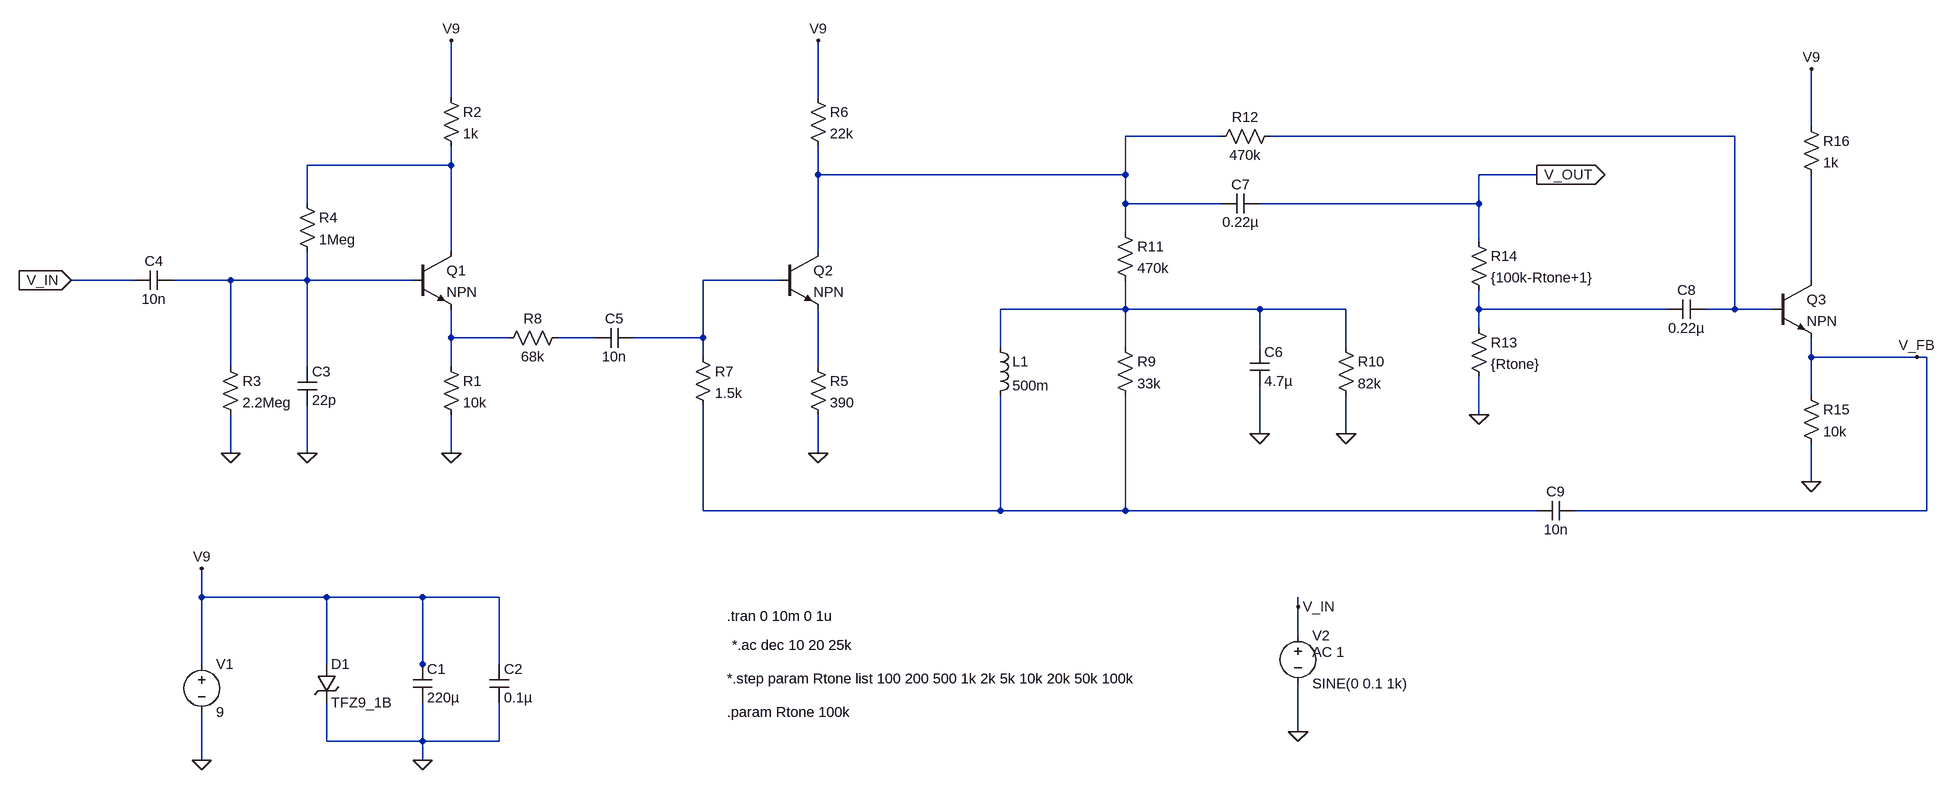
[diagram p0: schematic dunlop_crybaby.asc]
dunlop_crybaby.asc, the LTspice schematic file:
Version 4
SHEET 1 3760 680
WIRE 1072 -1056 1072 -1152
WIRE 1712 -1056 1712 -1152
WIRE 3536 -1008 3536 -1104
WIRE 2384 -992 2224 -992
WIRE 3408 -992 2464 -992
WIRE 1072 -944 1072 -976
WIRE 1072 -944 832 -944
WIRE 1712 -928 1712 -976
WIRE 2224 -928 2224 -992
WIRE 2224 -928 1712 -928
WIRE 2928 -928 2832 -928
WIRE 832 -880 832 -944
WIRE 2224 -880 2224 -928
WIRE 2384 -880 2224 -880
WIRE 2832 -880 2832 -928
WIRE 2832 -880 2448 -880
WIRE 2224 -832 2224 -880
WIRE 2832 -816 2832 -880
WIRE 1072 -800 1072 -944
WIRE 1712 -800 1712 -928
WIRE 544 -752 432 -752
WIRE 704 -752 608 -752
WIRE 832 -752 832 -800
WIRE 832 -752 704 -752
WIRE 1008 -752 832 -752
WIRE 1648 -752 1520 -752
WIRE 3536 -752 3536 -928
WIRE 2224 -704 2224 -752
WIRE 2224 -704 2016 -704
WIRE 2448 -704 2224 -704
WIRE 2592 -704 2448 -704
WIRE 2832 -704 2832 -736
WIRE 3296 -704 2832 -704
WIRE 3408 -704 3408 -992
WIRE 3408 -704 3360 -704
WIRE 3472 -704 3408 -704
WIRE 2832 -672 2832 -704
WIRE 1072 -656 1072 -704
WIRE 1168 -656 1072 -656
WIRE 1312 -656 1248 -656
WIRE 1520 -656 1520 -752
WIRE 1520 -656 1376 -656
WIRE 2016 -640 2016 -704
WIRE 2224 -640 2224 -704
WIRE 2448 -640 2448 -704
WIRE 2592 -640 2592 -704
WIRE 1520 -624 1520 -656
WIRE 3536 -624 3536 -656
WIRE 3712 -624 3536 -624
WIRE 3728 -624 3712 -624
WIRE 704 -608 704 -752
WIRE 832 -608 832 -752
WIRE 1072 -608 1072 -656
WIRE 1712 -608 1712 -704
WIRE 3536 -560 3536 -624
WIRE 2832 -528 2832 -592
WIRE 2448 -496 2448 -576
WIRE 2592 -496 2592 -560
WIRE 704 -464 704 -528
WIRE 832 -464 832 -544
WIRE 1072 -464 1072 -528
WIRE 1712 -464 1712 -528
WIRE 3536 -416 3536 -480
WIRE 1520 -368 1520 -544
WIRE 2016 -368 2016 -560
WIRE 2016 -368 1520 -368
WIRE 2224 -368 2224 -560
WIRE 2224 -368 2016 -368
WIRE 2928 -368 2224 -368
WIRE 3728 -368 3728 -624
WIRE 3728 -368 2992 -368
WIRE 656 -224 656 -272
WIRE 864 -224 656 -224
WIRE 1024 -224 864 -224
WIRE 1152 -224 1024 -224
WIRE 2512 -208 2512 -224
WIRE 2512 -160 2512 -208
WIRE 656 -112 656 -224
WIRE 864 -112 864 -224
WIRE 1024 -112 1024 -224
WIRE 1152 -112 1152 -224
WIRE 1024 -96 1024 -112
WIRE 2512 0 2512 -80
WIRE 864 16 864 -48
WIRE 1024 16 1024 -48
WIRE 1024 16 864 16
WIRE 1152 16 1152 -48
WIRE 1152 16 1024 16
WIRE 656 48 656 -32
WIRE 1024 48 1024 16
FLAG 656 48 0
FLAG 1024 48 0
FLAG 656 -272 V9
FLAG 704 -464 0
FLAG 832 -464 0
FLAG 1072 -464 0
FLAG 432 -752 V_IN
IOPIN 432 -752 In
FLAG 1072 -1152 V9
FLAG 1712 -464 0
FLAG 1712 -1152 V9
FLAG 2448 -496 0
FLAG 2592 -496 0
FLAG 2832 -528 0
FLAG 2928 -928 V_OUT
IOPIN 2928 -928 Out
FLAG 3536 -416 0
FLAG 3536 -1104 V9
FLAG 3712 -624 V_FB
FLAG 2512 0 0
FLAG 2512 -208 V_IN
SYMBOL voltage 656 -128 R0
WINDOW 123 0 0 Left 0
WINDOW 39 0 0 Left 0
SYMATTR InstName V1
SYMATTR Value 9
SYMBOL cap 1008 -112 R0
SYMATTR InstName C1
SYMATTR Value 220µ
SYMBOL cap 1136 -112 R0
SYMATTR InstName C2
SYMATTR Value 0.1µ
SYMBOL zener 848 -112 R0
SYMATTR InstName D1
SYMATTR Value TFZ9_1B
SYMATTR Description Diode
SYMATTR Type diode
SYMBOL npn 1008 -800 R0
SYMATTR InstName Q1
SYMBOL res 1056 -624 R0
SYMATTR InstName R1
SYMATTR Value 10k
SYMBOL res 1056 -1072 R0
SYMATTR InstName R2
SYMATTR Value 1k
SYMBOL res 688 -624 R0
SYMATTR InstName R3
SYMATTR Value 2.2Meg
SYMBOL cap 816 -608 R0
SYMATTR InstName C3
SYMATTR Value 22p
SYMBOL cap 608 -768 R90
WINDOW 0 0 32 VBottom 2
WINDOW 3 32 32 VTop 2
SYMATTR InstName C4
SYMATTR Value 10n
SYMBOL res 816 -896 R0
SYMATTR InstName R4
SYMATTR Value 1Meg
SYMBOL npn 1648 -800 R0
SYMATTR InstName Q2
SYMBOL res 1696 -624 R0
SYMATTR InstName R5
SYMATTR Value 390
SYMBOL res 1696 -1072 R0
SYMATTR InstName R6
SYMATTR Value 22k
SYMBOL res 1504 -640 R0
SYMATTR InstName R7
SYMATTR Value 1.5k
SYMBOL res 1264 -672 R90
WINDOW 0 0 56 VBottom 2
WINDOW 3 32 56 VTop 2
SYMATTR InstName R8
SYMATTR Value 68k
SYMBOL cap 1376 -672 R90
WINDOW 0 0 32 VBottom 2
WINDOW 3 32 32 VTop 2
SYMATTR InstName C5
SYMATTR Value 10n
SYMBOL ind 2000 -656 R0
SYMATTR InstName L1
SYMATTR Value 500m
SYMBOL res 2208 -656 R0
SYMATTR InstName R9
SYMATTR Value 33k
SYMBOL cap 2432 -640 R0
SYMATTR InstName C6
SYMATTR Value 4.7µ
SYMBOL res 2576 -656 R0
SYMATTR InstName R10
SYMATTR Value 82k
SYMBOL res 2208 -848 R0
SYMATTR InstName R11
SYMATTR Value 470k
SYMBOL res 2480 -1008 R90
WINDOW 0 0 56 VBottom 2
WINDOW 3 32 56 VTop 2
SYMATTR InstName R12
SYMATTR Value 470k
SYMBOL cap 2448 -896 R90
WINDOW 0 0 32 VBottom 2
WINDOW 3 32 32 VTop 2
SYMATTR InstName C7
SYMATTR Value 0.22µ
SYMBOL res 2816 -688 R0
SYMATTR InstName R13
SYMATTR Value {Rtone}
SYMBOL res 2816 -832 R0
SYMATTR InstName R14
SYMATTR Value {100k-Rtone+1}
SYMBOL cap 3360 -720 R90
WINDOW 0 0 32 VBottom 2
WINDOW 3 32 32 VTop 2
SYMATTR InstName C8
SYMATTR Value 0.22µ
SYMBOL npn 3472 -752 R0
SYMATTR InstName Q3
SYMBOL res 3520 -576 R0
SYMATTR InstName R15
SYMATTR Value 10k
SYMBOL res 3520 -1024 R0
SYMATTR InstName R16
SYMATTR Value 1k
SYMBOL cap 2992 -384 R90
WINDOW 0 0 32 VBottom 2
WINDOW 3 32 32 VTop 2
SYMATTR InstName C9
SYMATTR Value 10n
SYMBOL voltage 2512 -176 R0
WINDOW 123 24 44 Left 2
WINDOW 39 0 0 Left 0
SYMATTR InstName V2
SYMATTR Value SINE(0 0.1 1k)
SYMATTR Value2 AC 1
TEXT 1560 -88 Left 2 !*.step param Rtone list 100 200 500 1k 2k 5k 10k 20k 50k 100k
TEXT 1568 -144 Left 2 !*.ac dec 10 20 25k
TEXT 1560 -192 Left 2 !.tran 0 10m 0 1u
TEXT 1560 -32 Left 2 !.param Rtone 100k

The netlist it stands for:
* dunlop_crybaby.asc
V1 V9 0 9
C1 V9 0 220µ
C2 V9 0 0.1µ
D1 V9 0 TFZ9_1B
Q1 N003 N004 N009 0 NPN
R1 N009 0 10k
R2 V9 N003 1k
R3 N004 0 2.2Meg
C3 N004 0 22p
C4 N004 V_IN 10n
R4 N003 N004 1Meg
Q2 N001 N005 N011 0 NPN
R5 N011 0 390
R6 V9 N001 22k
R7 N005 N012 1.5k
R8 N010 N009 68k
C5 N005 N010 10n
L1 N007 N012 500m
R9 N007 N012 33k
C6 N007 0 4.7µ
R10 N007 0 82k
R11 N001 N007 470k
R12 N002 N001 470k
C7 V_OUT N001 0.22µ
R13 N008 0 {Rtone}
R14 V_OUT N008 {100k-Rtone+1}
C8 N002 N008 0.22µ
Q3 N006 N002 V_FB 0 NPN
R15 V_FB 0 10k
R16 V9 N006 1k
C9 V_FB N012 10n
V2 V_IN 0 SINE(0 0.1 1k) AC 1
.model D D
.lib standard.dio
.model NPN NPN
.model PNP PNP
.lib standard.bjt
*.step param Rtone list 100 200 500 1k 2k 5k 10k 20k 50k 100k
*.ac dec 10 20 25k
.tran 0 10m 0 1u
.param Rtone 100k
.backanno
.end